# EAGLE design rs232-sniffer (EAGLE 4.16)
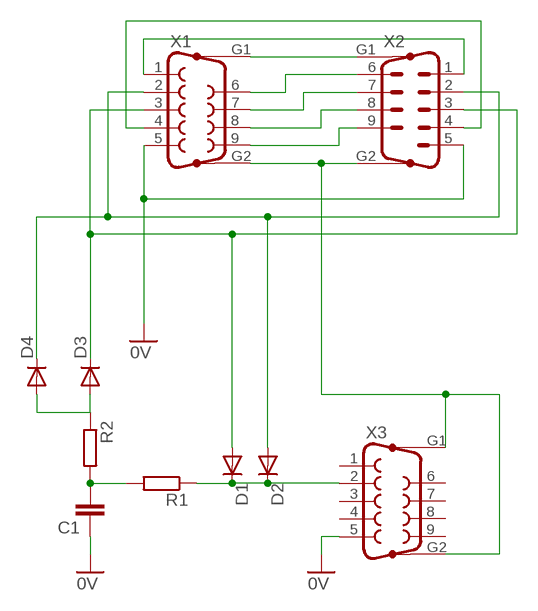
[diagram p0: schematic, sheet 1]

## Parts
C1  C-EU075-032X103  [C075-032X103]
D1  DIODE-D-7.5  [D-7.5]
D2  DIODE-D-7.5  [D-7.5]
D3  DIODE-D-7.5  [D-7.5]
D4  DIODE-D-7.5  [D-7.5]
R1  R-EU_0207/7  [0207/7]
R2  R-EU_0207/7  [0207/7]
X1  F09HP  [F09HP]
X2  M09HP  [M09HP]
X3  F09HP  [F09HP]

## Nets
0V: C1.1 X1.5 X2.5 X3.5
N$1: X1.6 X2.6
N$2: X1.7 X2.7
N$3: X1.8 X2.8
N$4: X1.9 X2.9
N$5: X1.G2 X2.G2 X3.G1 X3.G2
N$6: X1.G1 X2.G1
N$7: D3.A D4.A R2.1
N$8: X1.4 X2.4
N$9: D1.A D3.C X1.3 X2.3
N$10: X1.1 X2.1
N$11: D2.A D4.C X1.2 X2.2
N$12: D1.C D2.C R1.1 X3.2
N$13: C1.2 R1.2 R2.2
Unconnected: X3.1 X3.3 X3.4 X3.6 X3.7 X3.8 X3.9

## Library data of the parts
C1 = rcl:C-EU: CAPACITOR, European symbol
D1-D4 = diode:DIODE-: DIODE
R1 R2 = rcl:R-EU_: RESISTOR, European symbol
X1 X3 = con-subd:F09HP: SUB-D
X2 = con-subd:M09HP: SUB-D

## Board
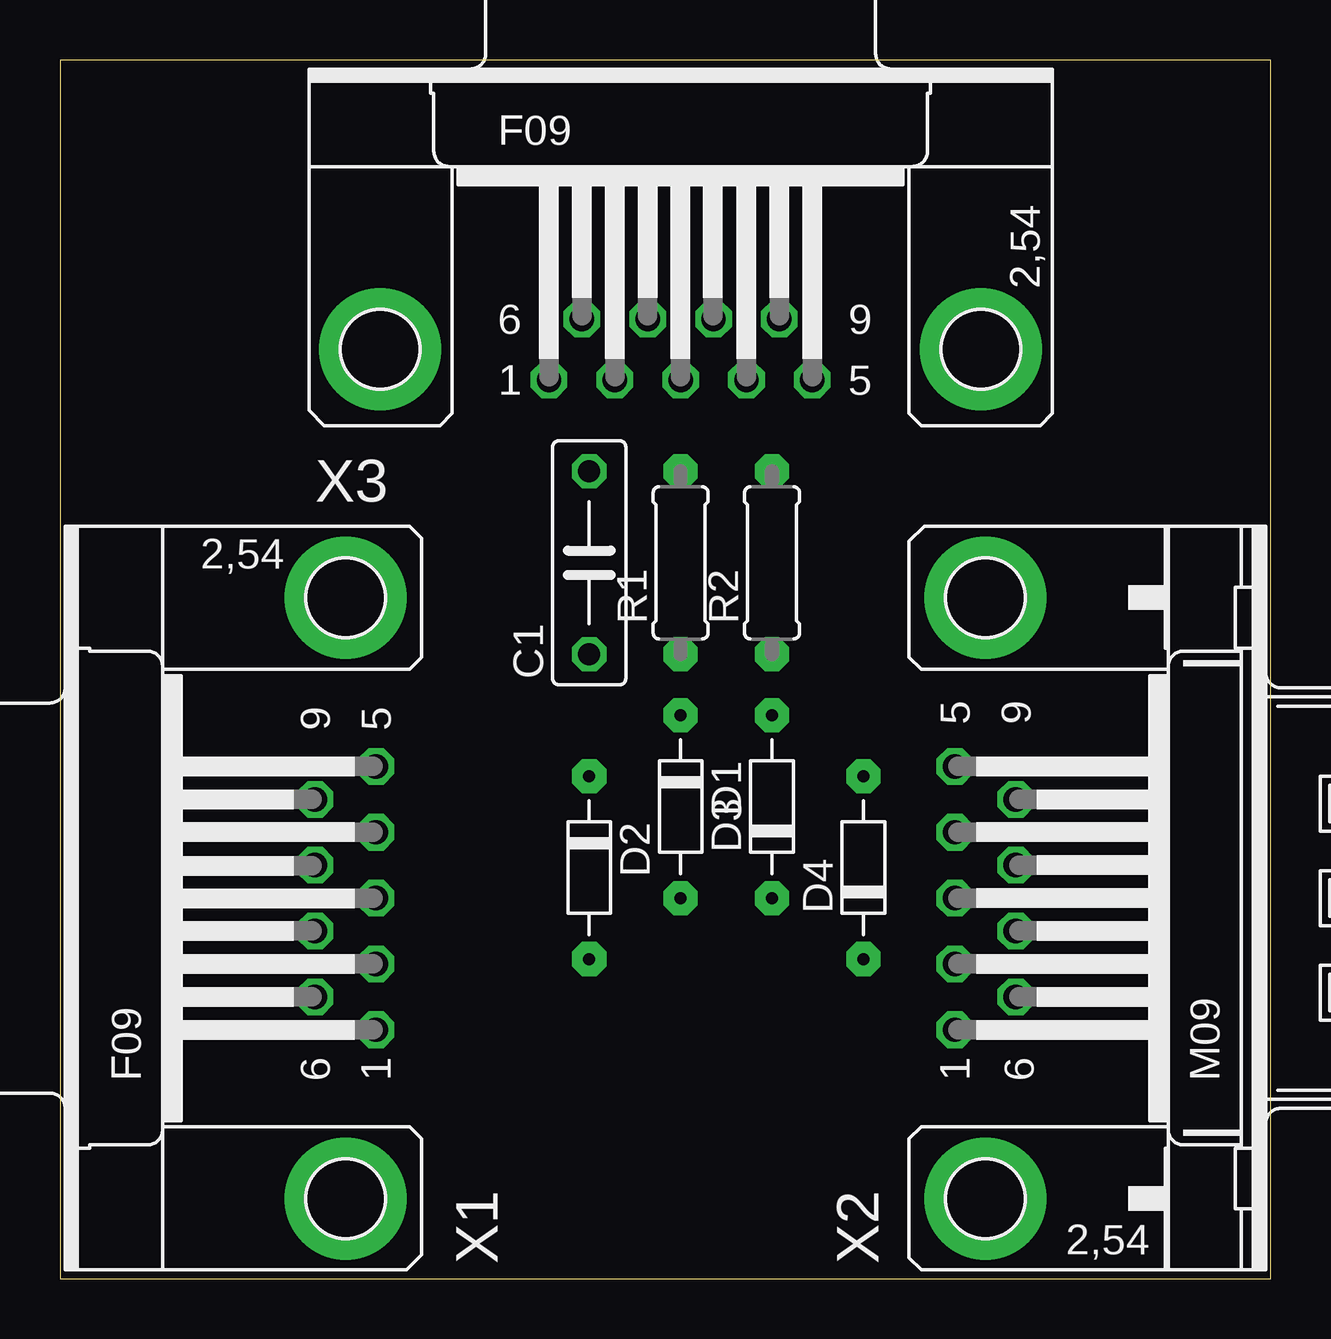
[diagram p1: board, top side]
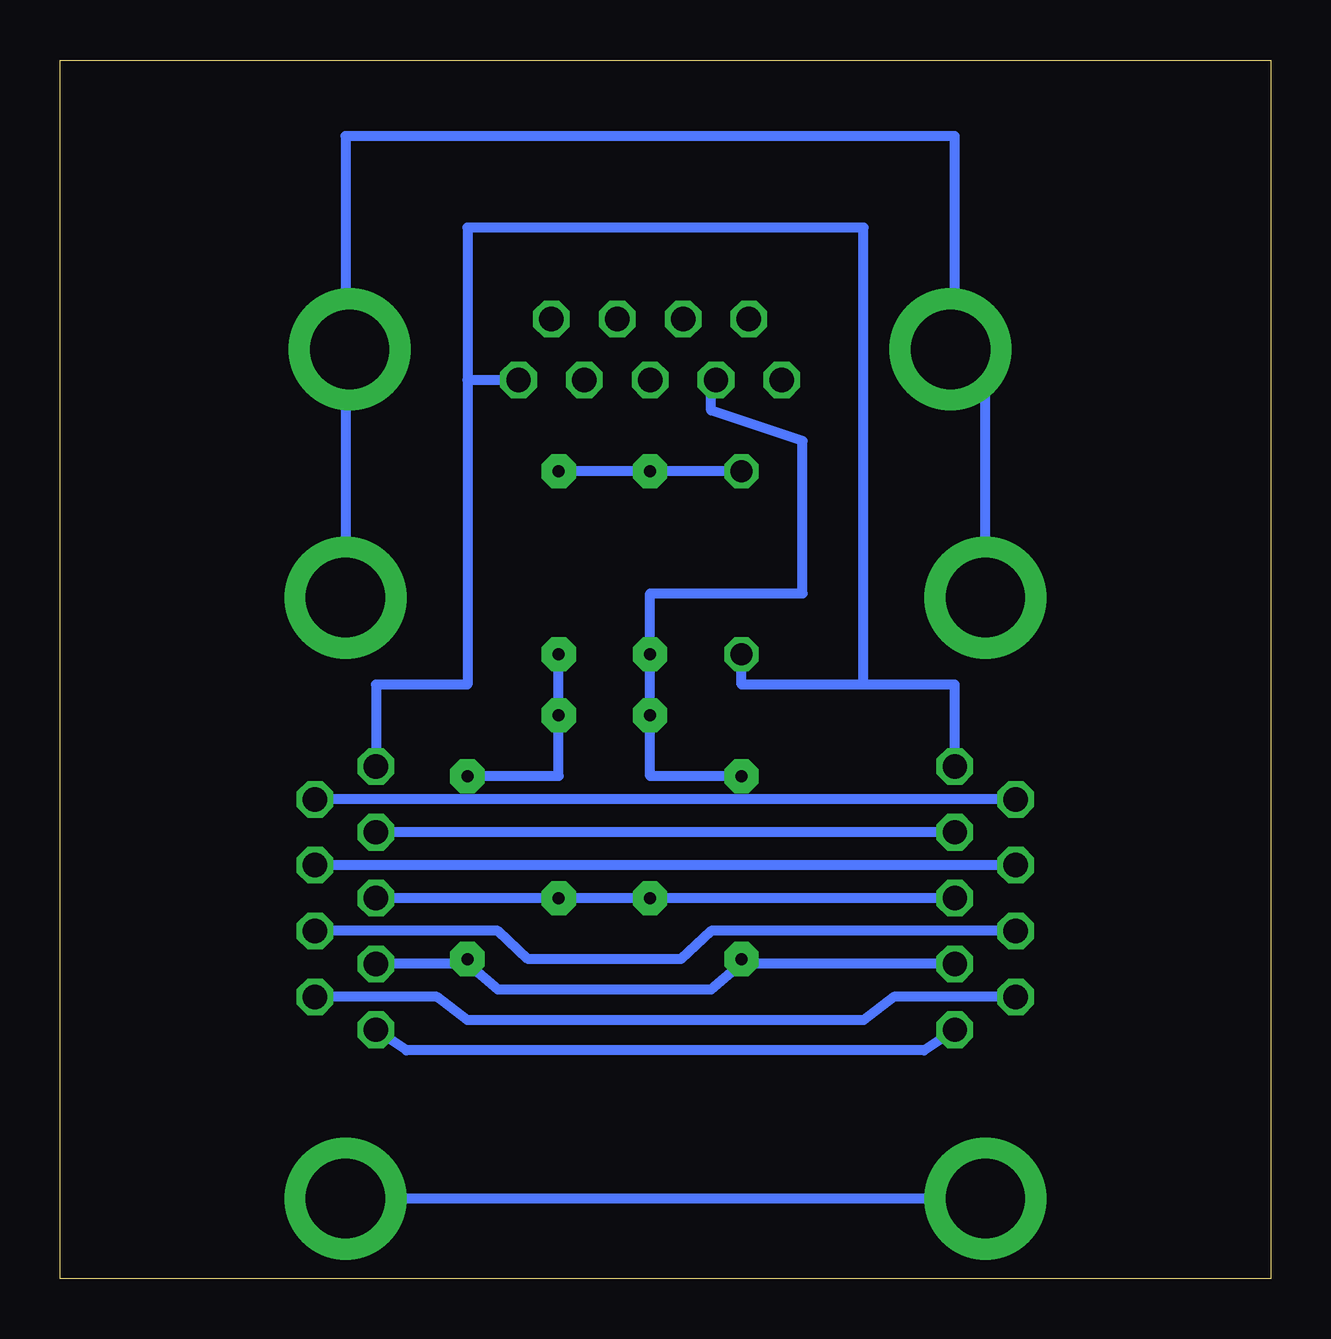
[diagram p2: board, bottom side, seen from below]

Size 50.47 x 50.79 mm. Coordinates in mm from the lower left corner, seen from the top.
Outline: 0,0 50.47,0 50.47,50.79 0,50.79 0,0
Copper layers (1*16): Top 0.035mm / dielectric 1.5mm / Bottom 0.035mm
Design rules "default": minimum track width 10mil, minimum drill 24mil, track to track 8mil, track to pad 8mil, pad to pad 8mil, via to via 8mil, smd to smd 8mil, copper to edge 40mil, drill to drill 8mil, minimum pad ring 10mil, minimum via ring 8mil, stop-mask expansion 4mil, vias tented up to drill 0mil, thermal gap 10mil

### Footprints (pad centres in the part's own frame; a part is rotated, then mirrored left to right if it is on the bottom)
C075-032X103 = drill 0.914 octagon: 1 -3.81,0; 2 3.81,0
D-7.5 = drill 0.5 pad 1.422 octagon: A 3.81,0; C -3.81,0
0207/7 = drill 0.5 pad 1.422 octagon: 1 -3.81,0; 2 3.81,0
F09HP = drill 1.016 octagon: 1 -5.486,-1.27; 2 -2.743,-1.27; 3 0,-1.27; 4 2.743,-1.27; 5 5.486,-1.27; 6 -4.115,1.27; 7 -1.372,1.27; 8 1.372,1.27; 9 4.115,1.27 | drill 3.302 pad 5.08 round: G1 -12.522,0; G2 12.522,0
M09HP = drill 1.016 octagon: 1 -5.486,1.27; 2 -2.743,1.27; 3 0,1.27; 4 2.743,1.27; 5 5.486,1.27; 6 -4.115,-1.27; 7 -1.372,-1.27; 8 1.372,-1.27; 9 4.115,-1.27 | drill 3.302 pad 5.08 round: G1 -12.522,0; G2 12.522,0

### Placement (x,y rotation side)
C1  22.06,29.84 90 top
D1  25.87,19.68 270 top
D2  22.06,17.14 270 top
D3  29.68,19.68 90 top
D4  33.49,17.14 90 top
R1  25.87,29.84 90 top
R2  29.68,29.84 90 top
X1  11.9,15.87 90 top
X2  38.57,15.87 90 top
X3  25.87,38.73 0 top

### Tracks (layer width: path | path; a pad name or v marks a point on that pad's centre or on a via)
0V
  Bottom 0.406: X1.5 13.17,24.76 16.98,24.76 | 16.98,24.76 22.06,24.76 C1.1 | 37.3,20.95 X2.5 37.3,24.76 33.49,24.76 33.49,37.46 | 33.49,37.46 X3.5 | 33.49,37.46 33.49,43.81 16.98,43.81 16.98,24.76
N$1
  Bottom 0.406: X1.6 15.71,11.75 16.98,10.79 33.49,10.79 34.76,11.75 X2.6
N$2
  Bottom 0.406: X1.7 23.33,14.5 24.6,13.33 30.95,13.33 32.22,14.5 X2.7
N$3
  Bottom 0.406: X1.8 X2.8 39.84,17.14
N$4
  Bottom 0.406: X1.9 X2.9 39.84,19.68
N$5
  Bottom 0.406: X1.G2 11.9,38.73 X3.G1 13.17,38.73 13.17,47.62 38.57,47.62 38.57,38.73 | 38.57,38.73 X2.G2 | 38.57,38.73 X3.G2
N$6
  Bottom 0.406: X1.G1 X2.G1 38.57,3.17
N$7
  Bottom 0.406: R2.1 D3.A 29.68,20.95 D4.A
N$8
  Bottom 0.406: X1.4 X2.4 37.3,18.41
N$9
  Bottom 0.406: X1.3 D1.A | D1.A D3.C | D3.C X2.3 D3.C | D1.A D3.C
N$10
  Bottom 0.406: X1.1 14.44,9.52 36.03,9.52 X2.1 37.3,10.79
N$11
  Bottom 0.406: X1.2 22.06,13.13 | 22.06,13.13 23.33,12.06 32.22,12.06 33.49,13.13 | 33.49,13.13 X2.2 37.3,13.33 | 22.06,13.13 D2.A | 33.49,13.13 D4.C
N$12
  Bottom 0.406: D2.C 25.87,20.95 D1.C R1.1 25.87,28.57 19.52,28.57 19.52,34.92 23.33,36.19 23.33,37.46 X3.2
N$13
  Bottom 0.406: C1.2 R1.2 R2.2